# EasyEDA Pro project 毕设.eprj, board PCB3
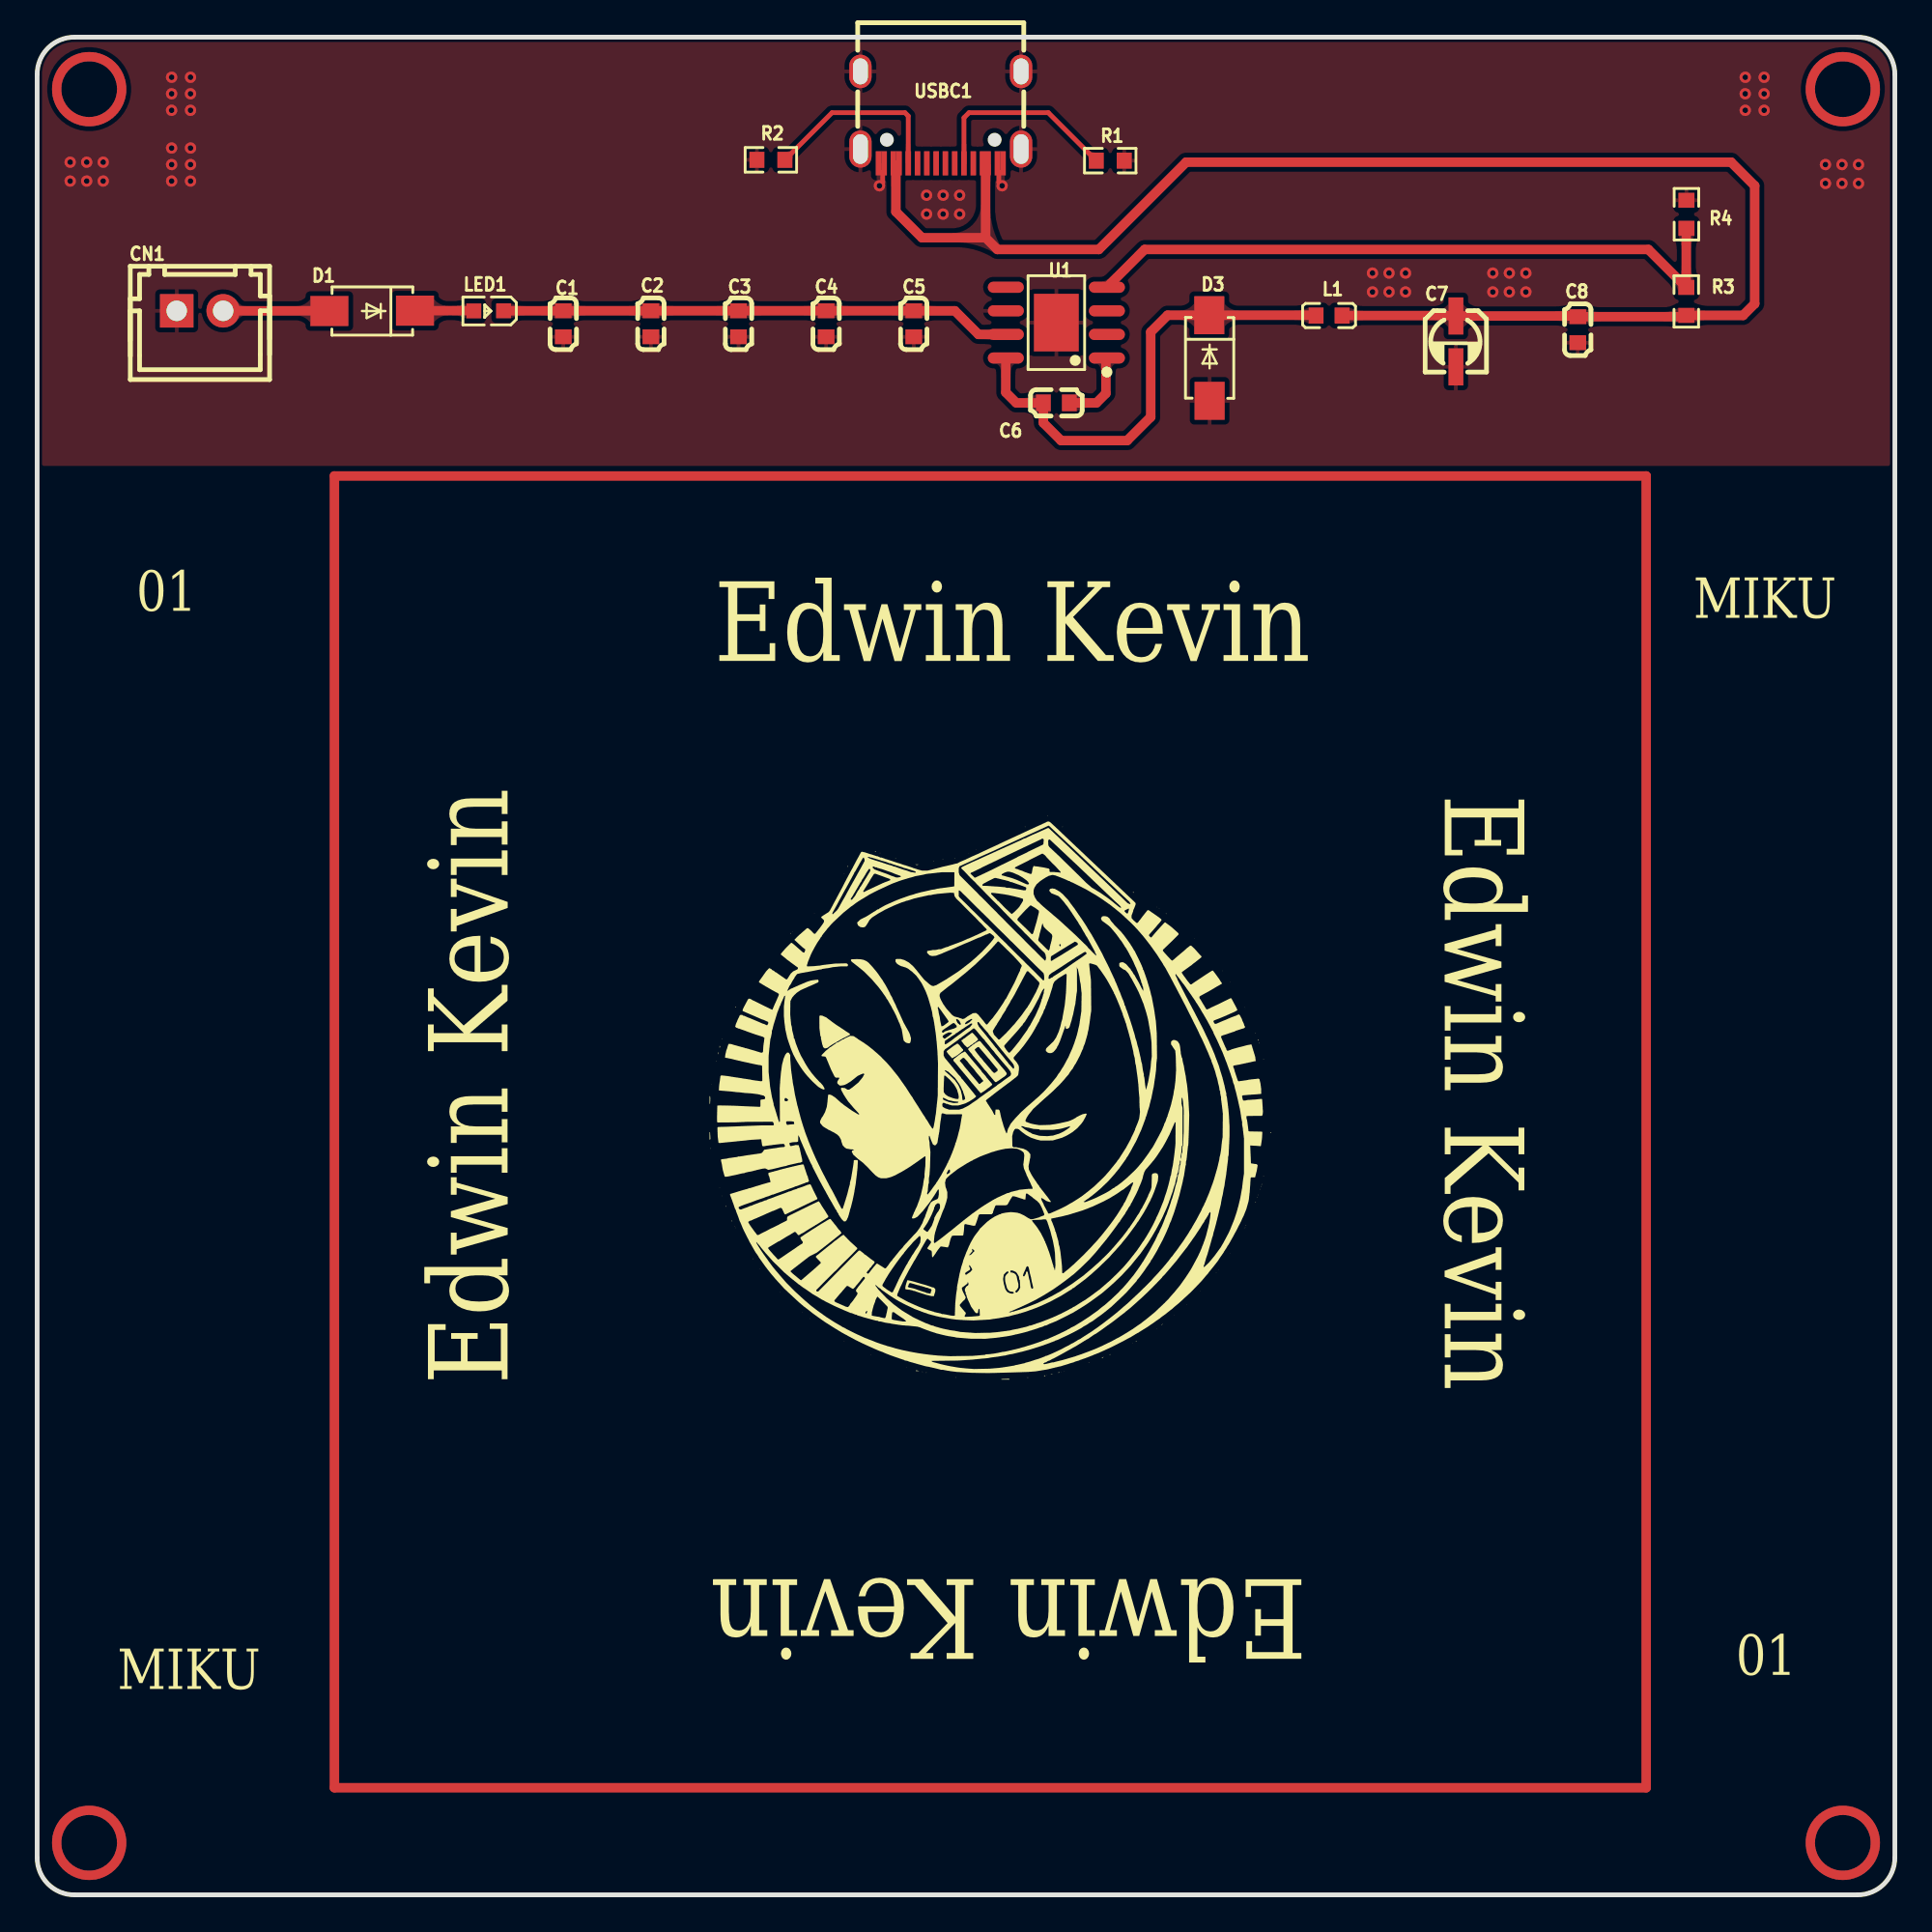
[diagram p4: board, top side]
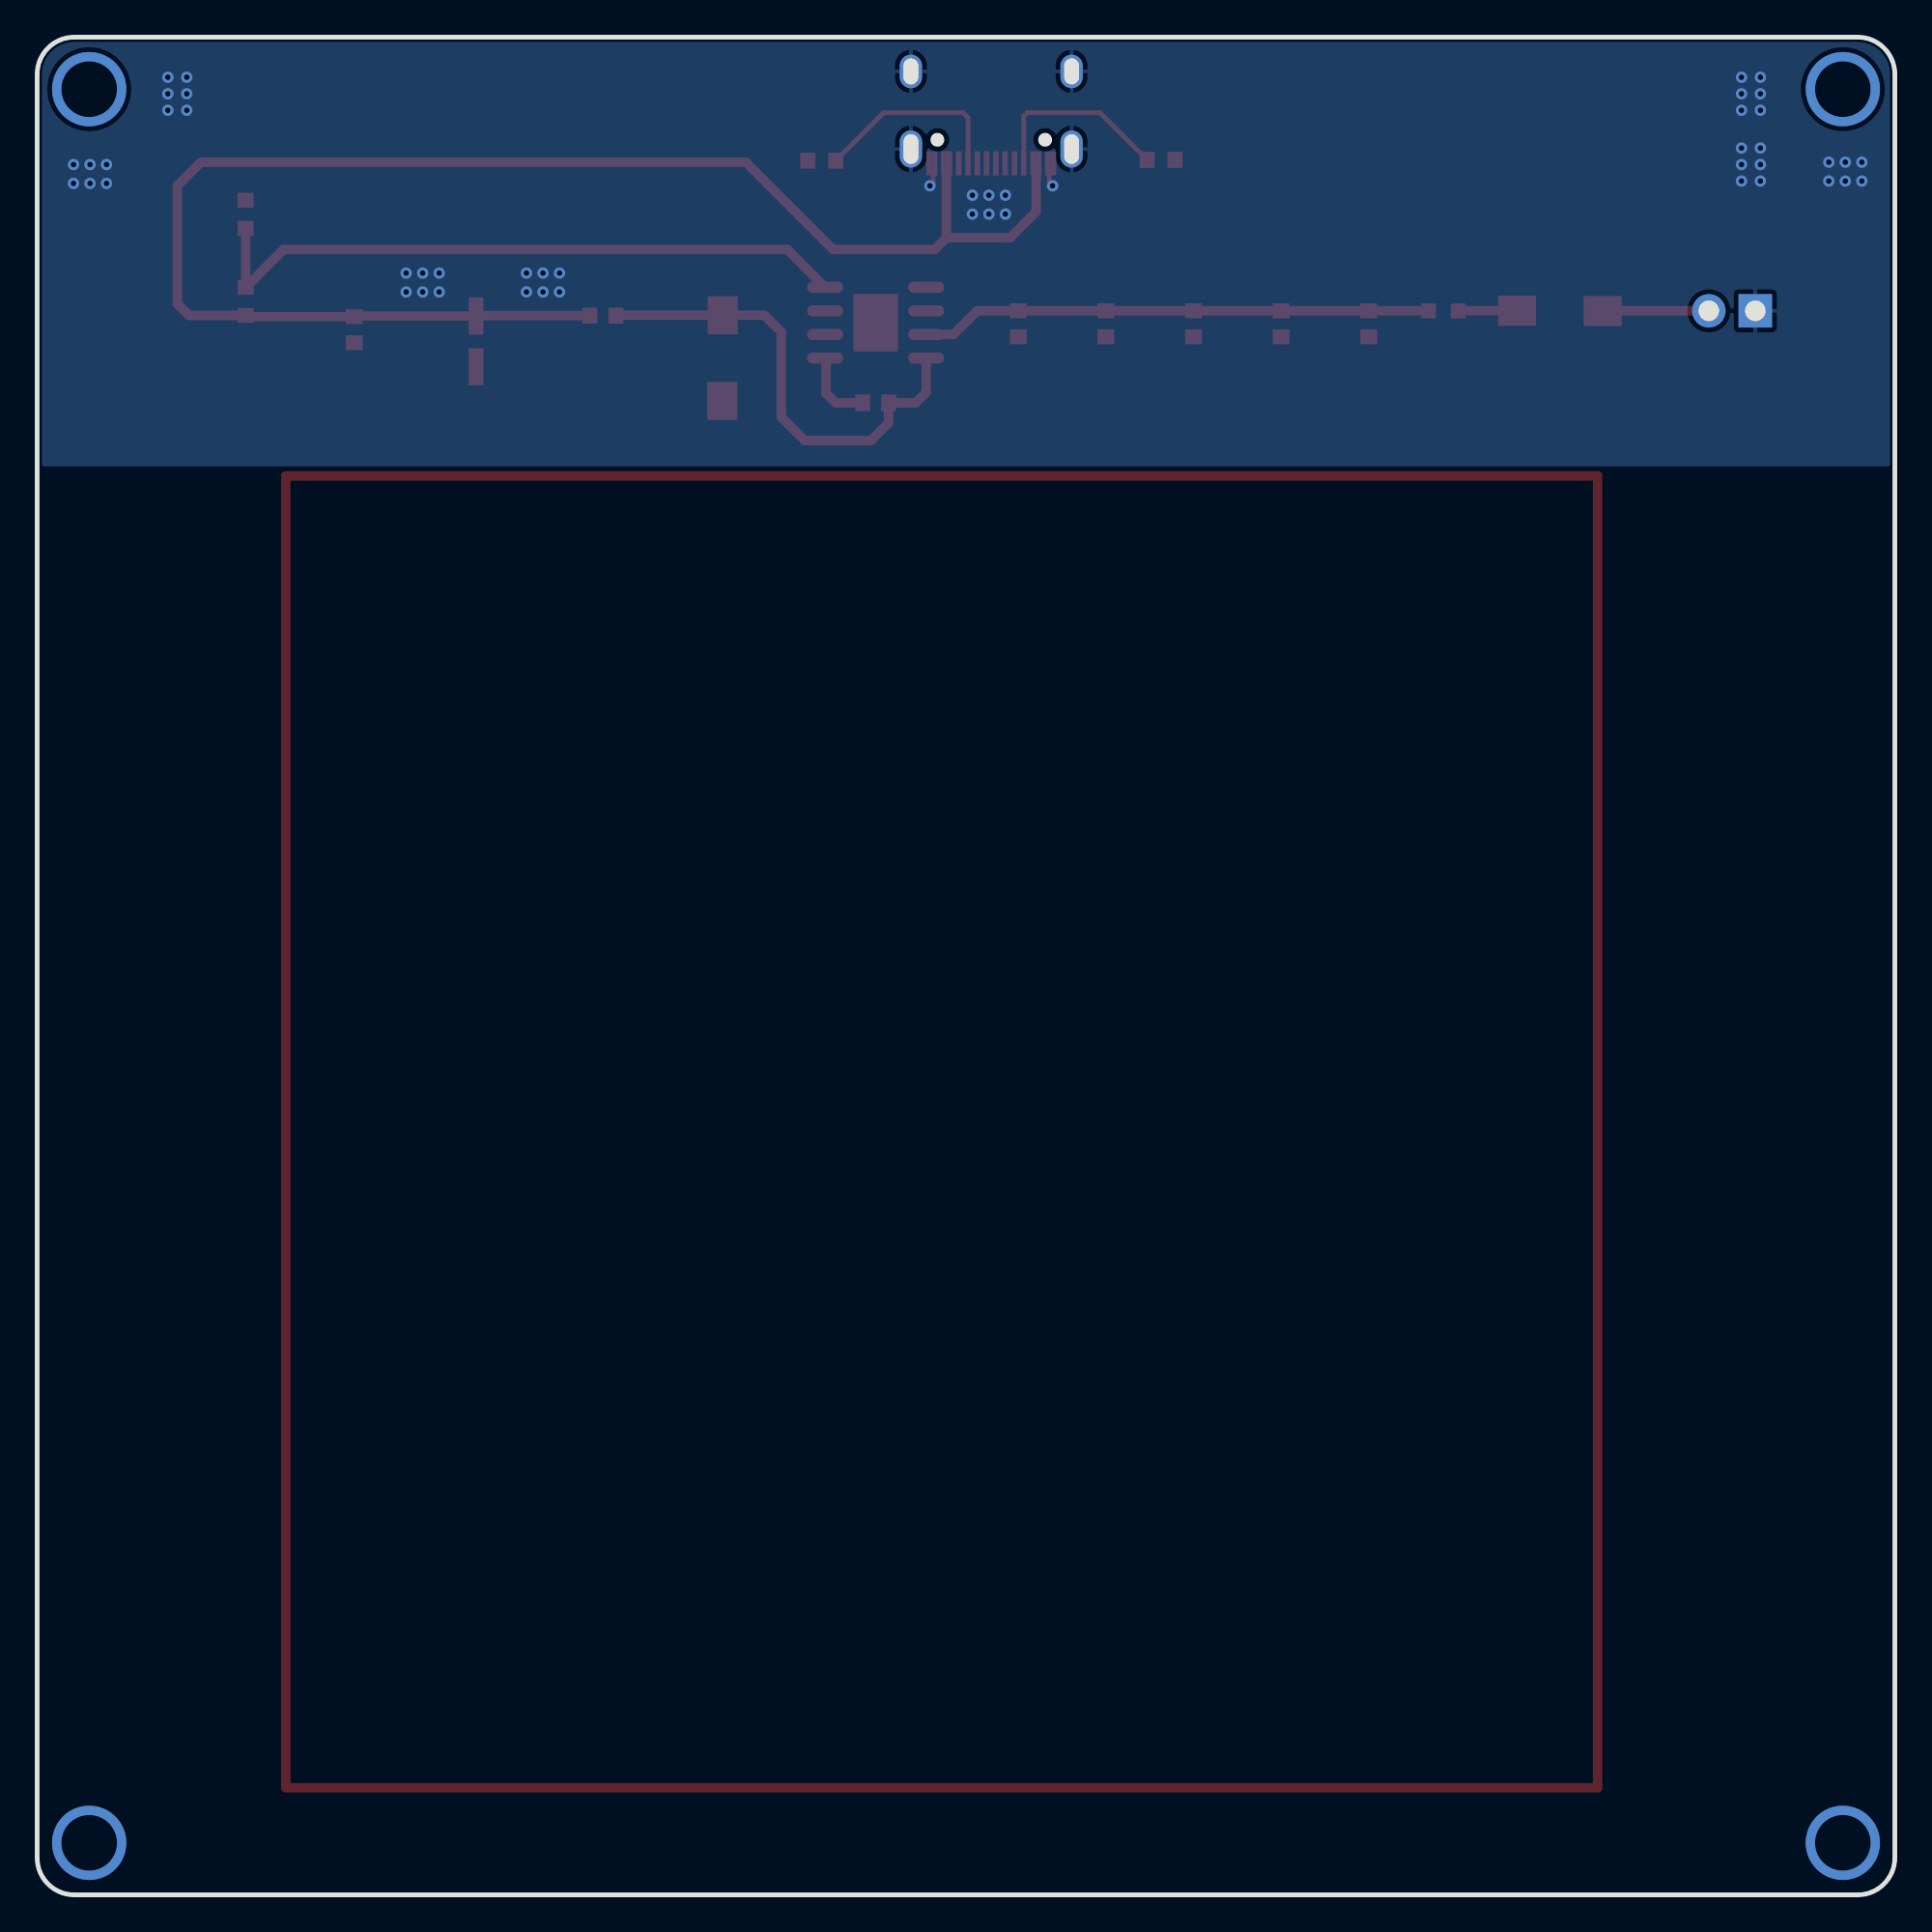
[diagram p5: board, bottom side, seen from below]

Outline 100 x 100 mm; copper layers: Top Layer, Bottom Layer. Coordinates in mm from the lower left corner of the outline.
Outline path: 0,98 0,2 arc(0.59,0.59) 2,0 98,0 arc(99.41,0.59) 100,2 100,98 arc(99.41,99.41) 98,100 2,100 arc(0.59,99.41) 0,98
Stack: Top Layer 0.035mm / Dielectric1 1.51mm FR4 er 4.5 / Bottom Layer 0.035mm

## Design rules (mm)
template: JLCPCB Capability(Two Layers Board)
spacing copperThickness1oz (default): track to track 0.102, other pairs 0.152 to 0.3
spacing copperThickness2oz: track to track 0.203, other pairs 0.152 to 0.3
track width copperThickness1oz (default): min 0.127, default 0.254, max 2.54
track width copperThickness2oz: min 0.203, default 0.254, max 2.54
differential pair differentialPair (default): width min 0.127, default 0.254, max 2.54; gap min 0.152, default 0.152
via viaSize (default): diameter min 0.5, default 0.61, max 10; hole min 0.3, default 0.305, max 6.3

## Placement (name value [footprint] x y rotation side)
C1  100nF  [C0603]  28.32 84.57 270 top
C2  100nF  [C0603]  33.04 84.57 270 top
C3  4.7μF  [C0603]  37.75 84.57 90 top
C4  4.7μF  [C0603]  42.47 84.57 90 top
C5  0.01μF  [C0603]  47.19 84.57 90 top
C6  0.01μF  [C0603]  54.86 80.31 180 top
C7  330uF  [C_Ele_SMD_3x5.4mm]  76.36 83.62 90 top
C8  0.01μF  [C0603]  82.93 84.25 90 top
CN1  ZX-XH2.54-2PZZ  [CONN-TH_2P-P2.50_HX25003-2A]  8.76 85.27 0 top
D1  SS54  [SMA_L4.3-W2.6-LS5.0-FD]  18.03 85.27 0 top
D3  SS54  [SMA_L4.3-W2.6-LS5.0-FD]  63.1 82.73 90 top
L1  15uH  [L0603]  69.54 85.01 0 top
LED1  -  [LED_0603]  24.26 85.26 180 top
R1  5.1K  [R0603]  57.76 93.35 0 top
R2  5.1K  [R0603]  39.5 93.4 180 top
R3  10K  [R0603]  88.77 85.78 270 top
R4  3.16KΩ  [R0603]  88.78 90.47 270 top
U1  TPS5450QDDARQ1  [SOIC-8_L4.9-W3.9-P1.27-LS6.0-BL-EP]  54.86 84.63 90 top
USBC1  TYPE-C-31-M-12  [USB-C_SMD-TYPE-C-31-M-12]  48.64 95.68 180 top

## Footprints (pads in the part's own frame, mm; a bottom-side part is the same pattern mirrored in y, then rotated)
C0603
  rect 0.8x0.9 smd: 1(-0.7,0) 2(0.7,0)
C_Ele_SMD_3x5.4mm
  rect 1.999x0.8 smd: 1(1.374,-0.014) 2(-1.364,-0.014)
CONN-TH_2P-P2.50_HX25003-2A
  rect 1.8x1.8 hole 1.1: 1(-1.25,0)
  round 1.8 hole 1.1: 2(1.25,0)
L0603
  rect 0.8x0.864 smd: 1(-0.7,0) 2(0.7,0)
LED_0603
  rect 0.8x0.8 smd: 1(-0.851,-0.01) 2(0.75,-0.005)
R0603
  rect 0.806x0.864 smd: 1(-0.753,0) 2(0.753,0)
SMA_L4.3-W2.6-LS5.0-FD
  rect 2.046x1.62 smd: 1(-2.304,-0.009) 2(2.304,0.009)
SOIC-8_L4.9-W3.9-P1.27-LS6.0-BL-EP
  oval 0.602x1.941 smd: 1(-1.905,-2.72) 2(-0.635,-2.72) 3(0.635,-2.72) 4(1.905,-2.72) 5(1.905,2.72) 6(0.635,2.72) 7(-0.635,2.72) 8(-1.905,2.72)
  rect 3.098x2.41 smd: 9(0,0)
USB-C_SMD-TYPE-C-31-M-12
  oval 1.2x2 hole 0.8x1.6: 0(-4.325,1.706) 1(4.325,1.706)
  oval 1.2x1.8 hole 0.8x1.4: 2(4.325,-2.474) 3(-4.325,-2.474)
  rect 0.3x1.3 smd: A1(-3.35,2.474) A4(-2.55,2.474) A5(-1.25,2.474) A6(-0.25,2.474) A7(0.25,2.474) A8(1.25,2.474) A9(2.55,2.474) A12(3.35,2.474) B1(3.05,2.474) B4(2.25,2.474) B5(1.75,2.474) B6(0.75,2.474) B7(-0.75,2.474) B8(-1.75,2.474) B9(-2.25,2.474) B12(-3.05,2.474)

## Nets
As in the schematic.

Pads without a net: U1 2 3 5; USBC1 A6 A7 A8 B6 B7 B8

## Via types
v1: diameter 4, hole 3, Top Layer to Bottom Layer, 4 vias
v2: diameter 0.61, hole 0.305, Top Layer to Bottom Layer, 50 vias

## Routing (per net, layer and track width the routed paths; a pad name or vN(x,y) marks a point on that pad's centre or on a via; arc(x,y) is an arc through that point)
GND: length 2.6
  Top Layer w0.254: USBC1.B12 51.69,92.81 51.77,92.73 51.77,92.17 v2(51.94,92) ; v2(45.34,92) 45.51,92.17 45.51,92.73 45.59,92.81 45.59,93.21
  vias: v2(1.78,93.27) v2(1.78,92.25) v2(2.67,93.27) v2(2.67,92.25) v2(3.56,93.27) v2(3.56,92.25) v2(7.24,97.84) v2(7.24,96.95) v2(7.24,96.06) v2(7.24,94.03) v2(7.24,93.14) v2(7.24,92.25) v2(8.25,97.84) v2(8.25,96.95) v2(8.25,96.06) v2(8.25,94.03) v2(8.25,93.14) v2(8.25,92.25) v2(47.88,91.49) v2(47.88,90.47) v2(48.77,91.49) v2(48.77,90.47) v2(49.66,91.49) v2(49.66,90.47) v2(71.88,87.3) v2(71.88,86.28) v2(72.77,87.3) v2(72.77,86.28) v2(73.66,87.3) v2(73.66,86.28) v2(78.36,87.3) v2(78.36,86.28) v2(79.25,87.3) v2(79.25,86.28) v2(80.14,87.3) v2(80.14,86.28) v2(91.95,97.84) v2(91.95,96.95) v2(91.95,96.06) v2(92.96,97.84) v2(92.96,96.95) v2(92.96,96.06) v2(96.27,93.14) v2(96.27,92.13) v2(97.16,93.14) v2(97.16,92.13) v2(98.04,93.14) v2(98.04,92.13)
VCC12V: length 27.6
  Top Layer w0.508: U1.7 50.67,84 49.4,85.27 47.19,85.27 C5.2 C4.2 C3.2 C2.1 C1.1 28.32,85.27 LED1.1
VCC+5V: length 84.4
  Top Layer w0.508: 51.05,89.2 47.62,89.2 46.23,90.6 46.23,93.1 ; 51.05,89.2 51.05,93.13 ; 51.05,89.2 51.69,88.57 57.15,88.57 61.85,93.27 91.19,93.27 92.46,92 92.46,85.65 91.83,85.02 R3.2 ; L1.2 76.35,85.01 C7.1 82.48,84.99 82.5,85.01 ; C8.2 88.72,84.95 88.77,85.01
(no net):
  vias: v1(2.8,97.2) v1(2.8,2.8) v1(97.2,97.2) v1(97.2,2.8)
CC1: length 10.8
  Top Layer w0.254: R1.1 54.43,95.94 50.16,95.94 49.89,95.66 USBC1.A5
CC2: length 10.3
  Top Layer w0.254: USBC1.B5 46.89,95.76 46.71,95.94 42.79,95.94 R2.1
$1N220: length 5.7
  Top Layer w0.508: CN1.2 15.72,85.27 D1.1
$1N3615: length 3.2
  Top Layer w0.508: LED1.2 23.49,85.28 D1.2
$1N3863: length 25.7
  Top Layer w0.508: U1.8 52.14,80.88 52.71,80.31 C6.2 54.16,79.24 55.12,78.28 58.67,78.28 59.94,79.55 59.94,84.12 60.85,85.03 D3.2 68.83,85.03 L1.1
$1N3888: length 4.1
  Top Layer w0.508: U1.1 57.53,82.67 57.53,80.82 57.02,80.31 C6.1
$1N3897: length 36.1
  Top Layer w0.508: R4.2 88.77,89.7 R3.1 86.73,88.57 59.62,88.57 U1.4

## Copper pours and planes (outline as drawn; the poured copper is in the pictures)
GND on Top Layer: -0.25,100.38 100,100.38 100,76.91 -0.25,76.91
GND on Bottom Layer: 0.05,100 100,100 100,76.89 0.05,76.89

Small or netless copper shapes (teardrops, artwork), in the pictures only: 44 on Top Layer

## Text on the board
Top Silkscreen Layer: 01 | MIKU | Edwin Kevin
